# Altium schematic sheet Nav_MCU_IO.SchDoc
size A
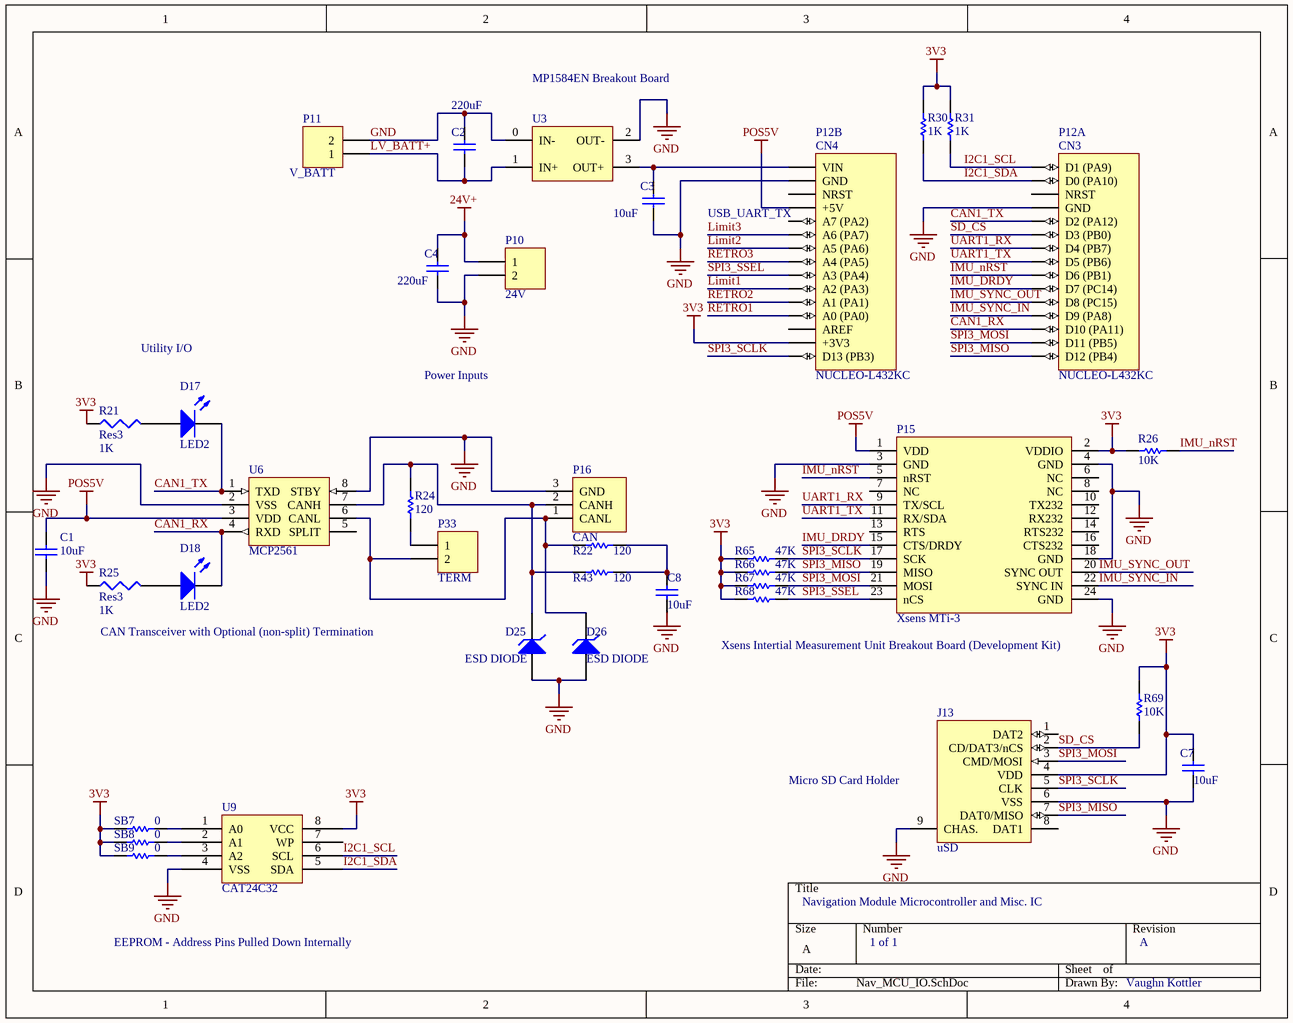
[diagram p0: Nav_MCU_IO.SchDoc]

## Parts
C1  value 10uF  [C1206]  (hidden comment: Cap)
C2  value 220uF  [CAPR5-4X5]  (hidden comment: Cap)
C3  value 10uF  [C1206]  (hidden comment: Cap)
C4  value 220uF  [CAPR5-4X5]  (hidden comment: Cap)
C7  value 10uF  [C1206]  (hidden comment: Cap)
C8  value 10uF  [C1206]  (hidden comment: Cap)
D17  LED2  [3.2X1.6X1.1]
D18  LED2  [3.2X1.6X1.1]
D25  ESD DIODE  [6-0805_M]
D26  ESD DIODE  [6-0805_M]
J13  uSD  [MICRO_SD_HOLDER]
P10  24V  [2POS TERM BLOCK]
P11  V_BATT  [2POS TERM BLOCK]
P12  NUCLEO-L432KC  [NUCLEO-32]  (parts A,B of 2)
P15  Xsens MTi-3  [Xsens]
P16  CAN  [3POS TERM BLOCK]
P33  TERM  [HDR1X2]
R21  Res3  value 1K  [J1-0603]
R22  value 120  [6-0805_M]  (hidden comment: Res1)
R24  value 120  [6-0805_M]  (hidden comment: Res1)
R25  Res3  value 1K  [J1-0603]
R26  value 10K  [6-0805_M]  (hidden comment: Res1)
R30  value 1K  [6-0805_M]  (hidden comment: Res1)
R31  value 1K  [6-0805_M]  (hidden comment: Res1)
R43  value 120  [6-0805_M]  (hidden comment: Res1)
R65  value 47K  [6-0805_M]  (hidden comment: Res1)
R66  value 47K  [6-0805_M]  (hidden comment: Res1)
R67  value 47K  [6-0805_M]  (hidden comment: Res1)
R68  value 47K  [6-0805_M]  (hidden comment: Res1)
R69  value 10K  [6-0805_M]  (hidden comment: Res1)
SB7  value 0  [6-0805_M]  (hidden comment: Res1)
SB8  value 0  [6-0805_M]  (hidden comment: Res1)
SB9  value 0  [6-0805_M]  (hidden comment: Res1)
U3  MP1584EN Breakout Board  [MP1584EN Breakout]
U6  MCP2561  [SO8_L]
U9  CAT24C32  [SO8_N]

## Nets
3V3: C7.2 J13.4(VDD) P12.17(+3V3) P15.2(VDDIO) R21.1 R25.1 R26.2 R30.2 R31.2 R65.1 R66.1 R67.1 R68.1 R69.1 SB7.2 SB8.2 SB9.2 U9.8(VCC)
24V+: C4.2 P10.1
GND: C1.1 C2.2 C3.1 C4.1 C7.1 C8.1 D25.1(A) D26.1(A) J13.6(VSS) J13.9(CHAS.) P10.2 P11.2 P12.4(GND) P12.29(GND) P15.3(GND) P15.4(GND) P15.18(GND) P15.24(GND) P16.3(GND) U3.0(IN-) U3.2(OUT-) U6.2(VSS) U6.8(STBY) U9.4(VSS)
POS5V: C1.2 P12.27(+5V) P15.1(VDD) U6.3(VDD)
CAN1_RX: D18.2(K) P12.13(D10_(PA11)) U6.4(RXD)
CAN1_TX: D17.2(K) P12.5(D2_(PA12)) U6.1(TXD)
I2C1_SCL: P12.1(D1_(PA9)) R31.1 U9.6(SCL)
I2C1_SDA: P12.2(D0_(PA10)) R30.1 U9.5(SDA)
IMU_DRDY: P12.10(D7_(PC14)) P15.15(CTS/DRDY)
IMU_nRST: P12.9(D6_(PB1)) P15.5(nRST) R26.1
IMU_SYNC_IN: P12.12(D9_(PA8)) P15.22(SYNC_IN)
IMU_SYNC_OUT: P12.11(D8_(PC15)) P15.20(SYNC_OUT)
Limit1: P12.21(A2_(PA3))
Limit2: P12.24(A5_(PA6))
Limit3: P12.25(A6_(PA7))
LV_BATT+: C2.1 P11.1 U3.1(IN+)
RETRO1: P12.19(A0_(PA0))
RETRO2: P12.20(A1_(PA1))
RETRO3: P12.23(A4_(PA5))
SD_CS: J13.2(CD/DAT3/nCS) P12.6(D3_(PB0)) R69.2
SPI3_MISO: J13.7(DAT0/MISO) P12.15(D12_(PB4)) P15.19(MISO) R66.2
SPI3_MOSI: J13.3(CMD/MOSI) P12.14(D11_(PB5)) P15.21(MOSI) R67.2
SPI3_SCLK: J13.5(CLK) P12.16(D13_(PB3)) P15.17(SCK) R65.2
SPI3_SSEL: P12.22(A3_(PA4)) P15.23(nCS) R68.2
UART1_RX: P12.7(D4_(PB7)) P15.9(TX/SCL)
UART1_TX: P12.8(D5_(PB6)) P15.11(RX/SDA)
NetC3_2: C3.2 P12.30(VIN) U3.3(OUT+)
NetC8_2: C8.2 R22.1 R43.1
NetD17_1: D17.1(A) R21.2
NetD18_1: D18.1(A) R25.2
NetD25_2: D25.2(K) P16.2(CANH) R24.2 R43.2 U6.7(CANH)
NetD26_2: D26.2(K) P16.1(CANL) P33.2 R22.2 U6.6(CANL)
NetP33_1: P33.1 R24.1
NetSB7_1: SB7.1 U9.1(A0)
NetSB8_1: SB8.1 U9.2(A1)
NetSB9_1: SB9.1 U9.3(A2)

Not connected (* = marked no-connect by the designer): J13 1(DAT2) 8(DAT1); P12 3(NRST) 18(AREF) 26(A7_(PA2)) 28(NRST); P15 6(NC) 7(NC) 8(NC) 10(TX232) 12(RX232) 13(RTS) 14(RTS232) 16(CTS232); U6 5(SPLIT); U9 7(WP)

## Notes on the sheet
- USB_UART_TX
- Utility I/O
- Power Inputs
- CAN Transceiver with Optional (non-split) Termination
- Xsens Intertial Measurement Unit Breakout Board (Development Kit)
- (near J13) Micro SD Card Holder
- Navigation Module Microcontroller and Misc. IC
- EEPROM - Address Pins Pulled Down Internally
- 1 of 1
- A
- Vaughn Kottler
- (in symbol NUCLEO-L432KC, part A) CN3
- (in symbol NUCLEO-L432KC, part B) CN4

## Library data of the parts
C1-C4 C7 C8 = Cap: Capacitor; Published: 8-Jun-2000; LatestRevisionDate: 17-Jul-2002; LatestRevisionNote: Re-released for DXP Platform.; PackageReference: RAD-0.3; Publisher: Altium Limited; PackageDescription: Radial Cap, Thru-Hole; 2 Leads; 0.3 in Pin Spacing
D17 D18 = LED2: Typical RED, GREEN, YELLOW, AMBER GaAs LED; Published: 8-Jun-2000; LatestRevisionDate: 17-Jul-2002; LatestRevisionNote: Re-released for DXP Platform.; PackageVersion: Feb-2002; PackageReference: 3.2X1.6X1.1; Publisher: Altium Limited; PackageDescription: SM LED; 2 Flat Leads
D25 D26 = D Zener: Zener Diode; Published: 8-Jun-2000; LatestRevisionDate: 17-Jul-2002; LatestRevisionNote: Re-released for DXP Platform.; PackageReference: DIODE-0.7; Publisher: Altium Limited; PackageDescription: Diode, Thru-Hole; 2 Leads; 0.7 in Pin Spacing
J13 = SD Card
P10 P11 P33 = Header 2: Header, 2-Pin; LatestRevisionDate: 17-Jul-2002; LatestRevisionNote: Re-released for DXP Platform.; Publisher: Altium Limited
P12 = NUCLEO-L432KC: STM32L432KC Development Board; ComponentLink1Description: MBED; ComponentLink1URL: https://os.mbed.com/platforms/ST-Nucleo-L432KC/; ComponentLink2Description: Digikey; ComponentLink2URL: https://www.digikey.com/products/en?keywords=NUCLEO-L432KC
P15 = Xsens MTi-3: IMU Development Board; ComponentLink1Description: Purchase; ComponentLink1URL: https://shop-us.xsens.com/shop/mti-1-series/mti-1-series-dk/mti-3-8a7g6-dk; ComponentLink2Description: Documentation; ComponentLink2URL: https://www.xsens.com/products/mti-1-series/
R21 R25 = Res3: Resistor; Published: 8-Jun-2000; LatestRevisionDate: 29-May-2009; LatestRevisionNote: IPC-7351 Footprint Added.; PackageReference: J1-0603; Publisher: Altium Limited; PackageDescription: Chip Resistor
R22 R24 R26 R30 R31 R43 R65-R69 SB7-SB9 = Res1: Resistor; Published: 8-Jun-2000; LatestRevisionDate: 17-Jul-2002; LatestRevisionNote: Re-released for DXP Platform.; PackageReference: AXIAL-0.3; Publisher: Altium Limited; PackageDescription: Axial Device, Thru-Hole; 2 Leads; 0.3 in Pin Spacing
U3 = MP1584EN Breakout Board: Buck Converter; ComponentLink1Description: Part; ComponentLink1URL: https://www.amazon.com/eBoot-MP1584EN-Converter-Adjustable-Module/dp/B01MQGMOKI/
U6 = MCP2561: CAN Transciever; ComponentLink1Description: Part; ComponentLink1URL: https://www.digikey.com/product-detail/en/microchip-technology/MCP2561-E-SN/MCP2561-E-SN-ND/4079961; ComponentLink2Description: Datasheet; ComponentLink2URL: http://ww1.microchip.com/downloads/en/DeviceDoc/20005167C.pdf
U9 = CAT24C32: I2C EEPROM; ComponentLink1Description: Part; ComponentLink1URL: https://www.digikey.com/product-detail/en/on-semiconductor/CAT24C32WI-GT3/CAT24C32WI-GT3CT-ND/1631159; ComponentLink2Description: Datasheet; ComponentLink2URL: http://www.onsemi.com/pub/Collateral/CAT24C32-D.PDF